# EAGLE board 2_auto (EAGLE 5.10)
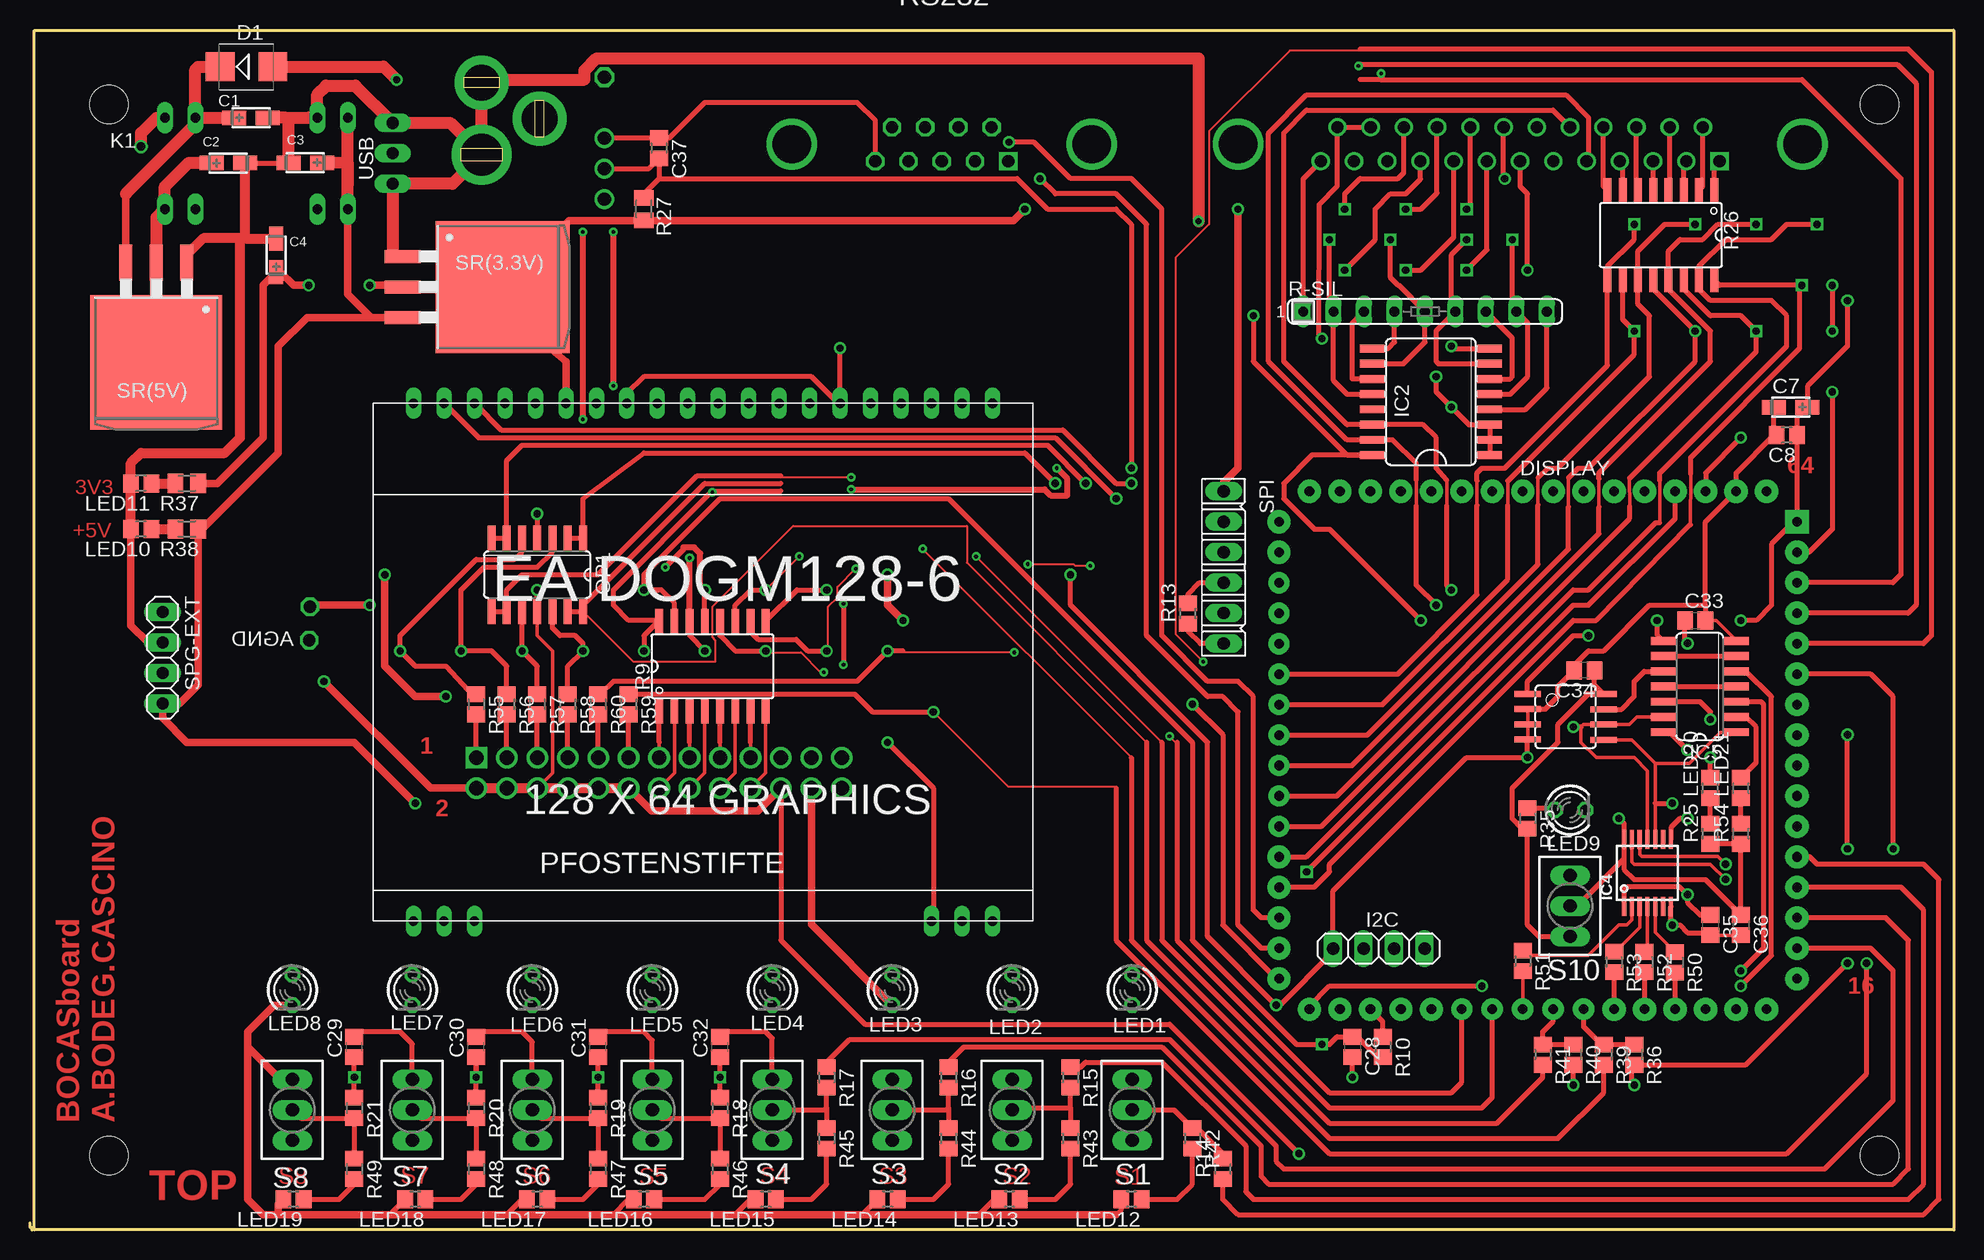
[diagram p2: board, top side]
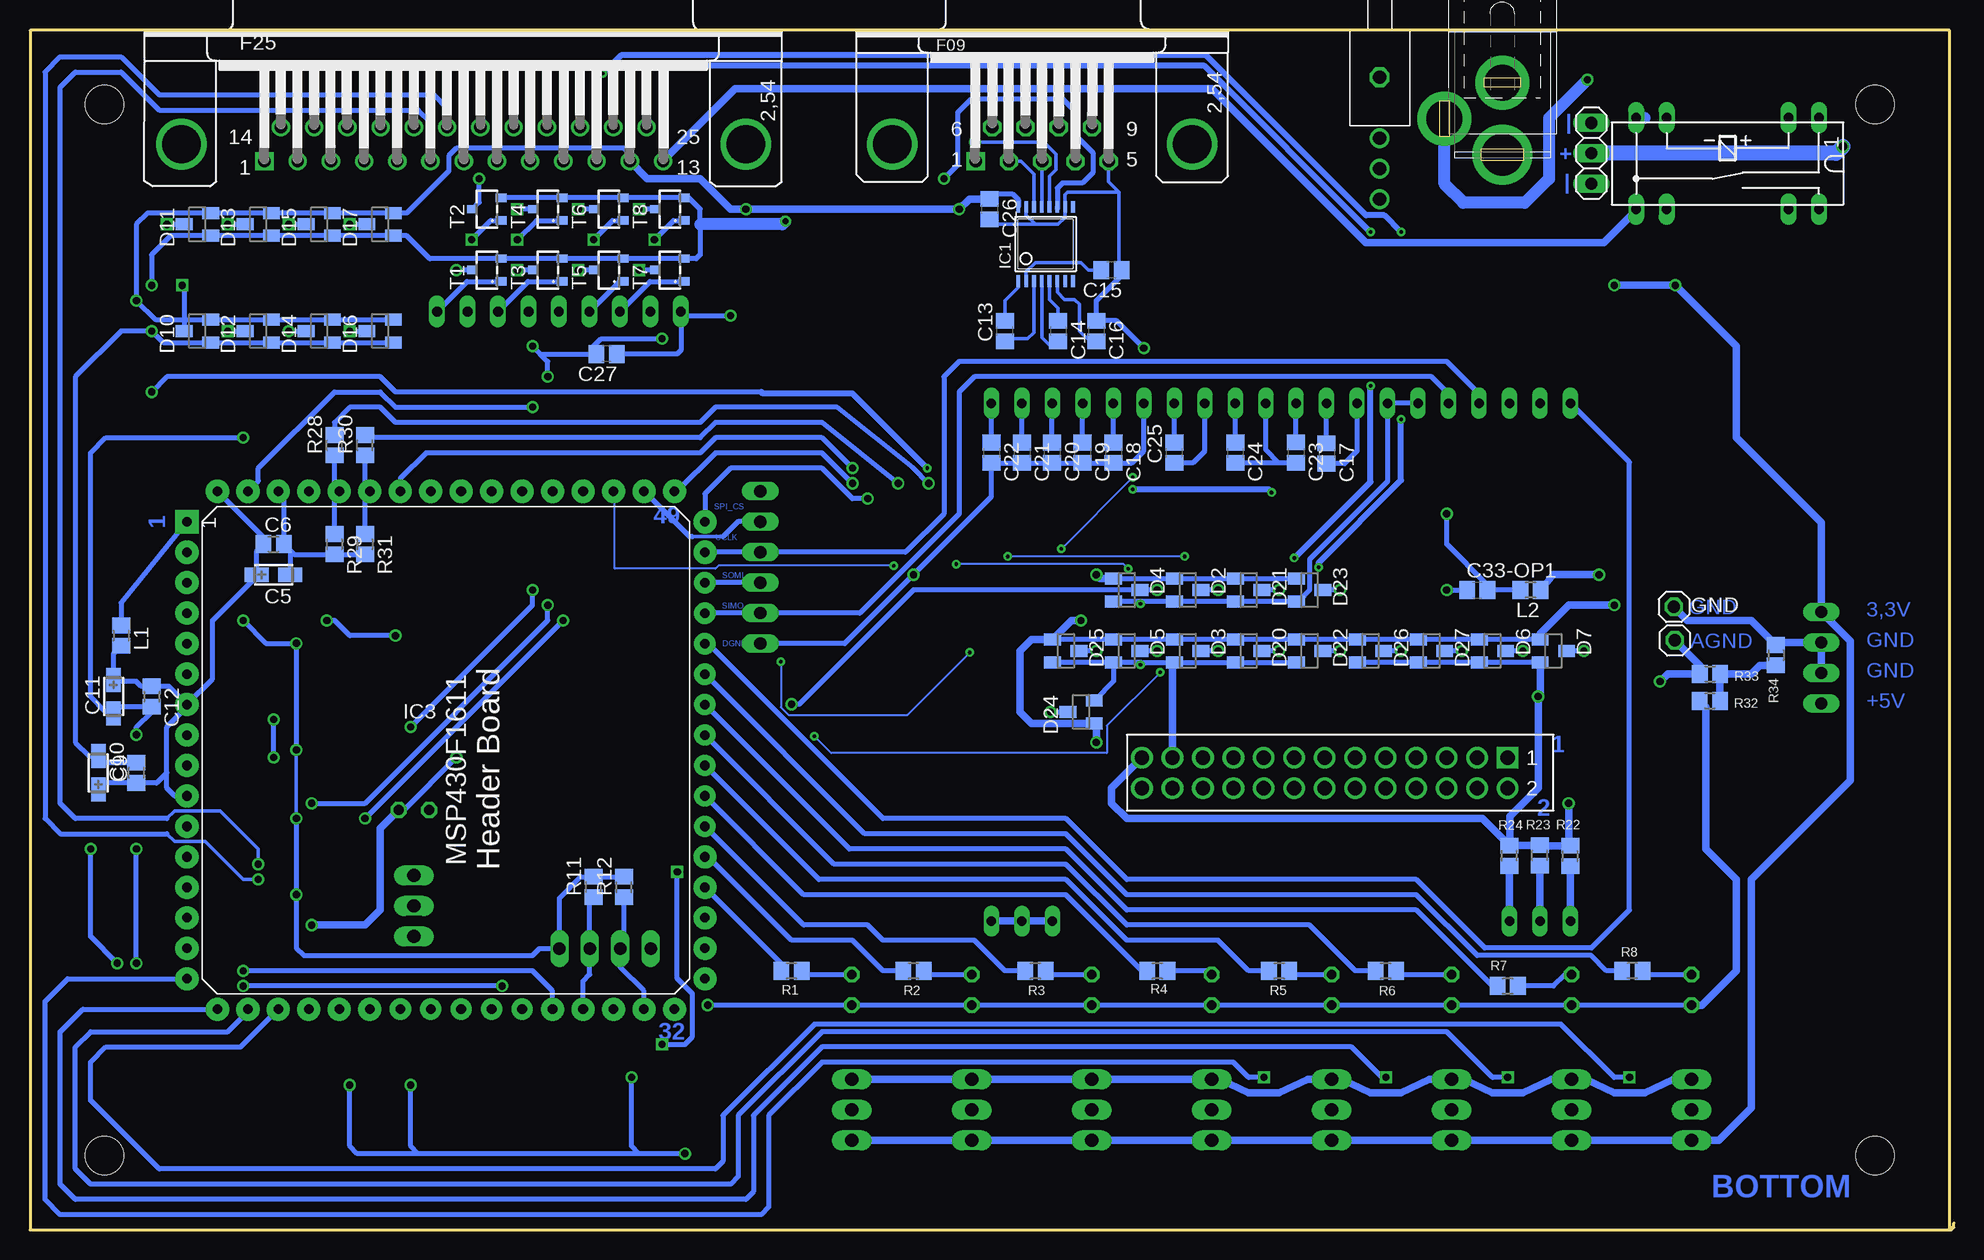
[diagram p3: board, bottom side, seen from below]

Size 160.37 x 100.02 mm. Coordinates in mm from the lower left corner, seen from the top.
Outline: 160.37,100 0.37,100
Outline: 0.37,0 0.37,100
Outline: 0.37,100 160.34,100.02 160.37,100
Outline: 160.37,100 160.37,0 0.37,0
Outline: 0.37,0 0.18,0 0.18,0.18 0,0.18 0,0.56
Copper layers (1*16): Top 0.035mm / dielectric 1.5mm / Bottom 0.035mm
Design rules "default *": minimum track width 6mil, minimum drill 12mil, track to track 8mil, track to pad 8mil, pad to pad 8mil, via to via 8mil, smd to smd 8mil, copper to edge 40mil, drill to drill 8mil, minimum pad ring 10mil, minimum via ring 8mil, stop-mask expansion 4mil, vias tented up to drill 0mil, thermal gap 10mil
Net classes: 1 Power: width 0.61 mm, drill 0.406 mm, clearance 0.203 mm; 2 High Strom: width 1.016 mm, drill 0.508 mm, clearance 0.203 mm; 3 Digital: width 0.152 mm, drill 0.305 mm, clearance 0.152 mm; 4 Analog: width 0.508 mm, drill 0.305 mm, clearance 0.203 mm; 5 VCC +3.3V: width 0.406 mm, drill 0.305 mm, clearance 0.203 mm
Holes 3.2 mm at 6.57,93.8 6.57,6.2 154.17,6.2 154.17,93.8

## Footprints (pad centres in the part's own frame; a part is rotated, then mirrored left to right if it is on the bottom)
1X01 = drill 1.016 octagon: 1 0,0
CT3216 = smd 2 x 1.2: + 1.4,0; - -1.4,0
R0805 = smd 1.3 x 1.5: 1 -0.85,0; 2 0.85,0
C0805 = smd 1.3 x 1.5: 1 -0.85,0; 2 0.85,0
SMB = smd 2.4 x 2.4: A 2.2,0; C -2.2,0
SOT23 = smd 1 x 1.4: 1 -0.95,-1.1; 2 0.95,-1.1; 3 0,1.1
F25-HORIZONTAL_2 = drill 1.016 square: 1 16.62,10.92 | drill 1.016 round: 2 13.85,10.92; 3 11.08,10.92; 4 8.31,10.92; 5 5.54,10.92; 6 2.77,10.92; 7 0,10.92; 8 -2.77,10.92; 9 -5.54,10.92; 10 -8.31,10.92; 11 -11.08,10.92; 12 -13.85,10.92; 13 -16.62,10.92; 14 15.235,8.08; 15 12.465,8.08; 16 9.695,8.08; 17 6.925,8.08; 18 4.155,8.08; 19 1.385,8.08; 20 -1.385,8.08; 21 -4.155,8.08; 22 -6.925,8.08; 23 -9.695,8.08; 24 -12.465,8.08; 25 -15.235,8.08 | drill 3.2 round: P$1 -23.52,9.5; P$2 23.52,9.5
EADOGM128 = drill 0.8 long: 1 -24.13,-21.59; 2 -21.59,-21.59; 3 -19.05,-21.59; 18 19.05,-21.59; 19 21.59,-21.59; 20 24.13,-21.59; 21 24.13,21.59; 22 21.59,21.59; 23 19.05,21.59; 24 16.51,21.59; 25 13.97,21.59; 26 11.43,21.59; 27 8.89,21.59; 28 6.35,21.59; 29 3.81,21.59; 30 1.27,21.59; 31 -1.27,21.59; 32 -3.81,21.59; 33 -6.35,21.59; 34 -8.89,21.59; 35 -11.43,21.59; 36 -13.97,21.59; 37 -16.51,21.59; 38 -19.05,21.59; 39 -21.59,21.59; 40 -24.13,21.59
1X04 = drill 1.016 long: 1 -3.81,0; 2 -1.27,0; 3 1.27,0; 4 3.81,0
TSSOP16 = smd 0.305 x 0.991: 1 -2.275,-3.1; 2 -1.625,-3.1; 3 -0.975,-3.1; 4 -0.325,-3.1; 5 0.325,-3.1; 6 0.975,-3.1; 7 1.625,-3.1; 8 2.275,-3.1; 9 2.275,3.1; 10 1.625,3.1; 11 0.975,3.1; 12 0.325,3.1; 13 -0.325,3.1; 14 -0.975,3.1; 15 -1.625,3.1; 16 -2.275,3.1
SO16L = smd 0.66 x 2.032: 1 -4.445,-4.902; 2 -3.175,-4.902; 3 -1.905,-4.902; 4 -0.635,-4.902; 5 0.635,-4.902; 6 1.905,-4.902; 7 3.175,-4.902; 8 4.445,-4.902; 9 4.445,4.902; 10 3.175,4.902; 11 1.905,4.902; 12 0.635,4.902; 13 -0.635,4.902; 14 -1.905,4.902; 15 -3.175,4.902; 16 -4.445,4.902
SOIC8 = smd 0.5 x 2.2: 1 -1.905,-3.154; 2 -0.645,-3.154; 3 0.625,-3.154; 4 1.895,-3.154; 5 1.905,3.154; 6 0.635,3.154; 7 -0.635,3.154; 8 -1.905,3.154
TSSOP14 = smd 0.35 x 1.6: 1 -1.95,-2.8; 2 -1.3,-2.8; 3 -0.65,-2.8; 4 0,-2.8; 5 0.65,-2.8; 6 1.3,-2.8; 7 1.95,-2.8; 8 1.95,2.8; 9 1.3,2.8; 10 0.65,2.8; 11 0,2.8; 12 -0.65,2.8; 13 -1.3,2.8; 14 -1.95,2.8
SO14 = smd 0.66 x 2.032: 1 -3.81,-3.073; 2 -2.54,-3.073; 3 -1.27,-3.073; 4 0,-3.073; 5 1.27,-3.073; 6 2.54,-3.073; 7 3.81,-3.073; 8 3.81,3.073; 9 2.54,3.073; 10 1.27,3.073; 11 0,3.073; 12 -1.27,3.073; 13 -2.54,3.073; 14 -3.81,3.073
RR1U = drill 0.813 long: 1 -7.62,-3.81; 2 -5.08,-3.81; 6 5.08,-3.81; 7 7.62,-3.81; 8 7.62,3.81; 9 5.08,3.81; 13 -5.08,3.81; 14 -7.62,3.81
LED3MM = drill 0.813 octagon: A -1.27,0; K 1.27,0
ML26 = drill 1.2 square: 1 -15.24,-1.27 | drill 1.2 round: 2 -15.24,1.27; 3 -12.7,-1.27; 4 -12.7,1.27; 5 -10.16,-1.27; 6 -10.16,1.27; 7 -7.62,-1.27; 8 -7.62,1.27; 9 -5.08,-1.27; 10 -5.08,1.27; 11 -2.54,-1.27; 12 -2.54,1.27; 13 0,-1.27; 14 0,1.27; 15 2.54,-1.27; 16 2.54,1.27; 17 5.08,-1.27; 18 5.08,1.27; 19 7.62,-1.27; 20 7.62,1.27; 21 10.16,-1.27; 22 10.16,1.27; 23 12.7,-1.27; 24 12.7,1.27; 25 15.24,-1.27; 26 15.24,1.27
SO16-F = smd 0.66 x 2.032: 1 -4.445,-3.748; 2 -3.175,-3.748; 3 -1.905,-3.748; 4 -0.635,-3.748; 5 0.635,-3.748; 6 1.905,-3.748; 7 3.175,-3.748; 8 4.445,-3.748; 9 4.445,3.748; 10 3.175,3.748; 11 1.905,3.748; 12 0.635,3.748; 13 -0.635,3.748; 14 -1.905,3.748; 15 -3.175,3.748; 16 -4.445,3.748
M0805 = smd 1.3 x 1.6: 1 -0.95,0; 2 0.95,0
SIL9 = drill 0.813 long: 1 -10.16,0; 2 -7.62,0; 3 -5.08,0; 4 -2.54,0; 5 0,0; 6 2.54,0; 7 5.08,0; 8 7.62,0; 9 10.16,0
F09-H1 = drill 1.016 square: 1 5.54,10.92 | drill 1.016 octagon: 2 2.77,10.92; 3 0,10.92; 4 -2.77,10.92; 5 -5.54,10.92; 6 4.155,8.08; 7 1.385,8.08; 8 -1.385,8.08; 9 -4.155,8.08 | drill 3.2 round: P$1 -12.495,9.5; P$2 12.495,9.5
2MS = drill 1.1 pad 1.422 long: 1 -2.54,0; 2 0,0; 3 2.54,0
KIPPTASTER-90 = drill 1.1 round: P1 0,2.54; P2 0,5.08; P3 0,7.62 | drill 1.1 octagon: P$4 0,-2.54
PFOSTENSTECKER-P06 = drill 1.016 long: 1 -6.35,0; 2 -3.81,0; 3 -1.27,0; 4 1.27,0; 5 3.81,0; 6 6.35,0
TO263-3 = smd 1.067 x 3: 1 -2.54,-5.791; 2 0,-5.791; 3 2.54,-5.791 | smd 11 x 11.2: TAB 0,2.54
SOT346 = smd 0.7 x 0.9: 1 -0.95,-1.2; 2 0.95,-1.2; 3 0,1.2
MCKU = drill 0.8 pad 1.93 square: 1 -22.86,-20.32 | drill 0.8 pad 1.93 round: 2 -20.32,-20.32; 3 -17.78,-20.32; 4 -15.24,-20.32; 5 -12.7,-20.32; 6 -10.16,-20.32; 7 -7.62,-20.32; 8 -5.08,-20.32; 9 -2.54,-20.32; 10 0,-20.32; 11 2.54,-20.32; 12 5.08,-20.32; 13 7.62,-20.32; 14 10.16,-20.32; 15 12.7,-20.32; 16 15.24,-20.32; 17 17.78,-17.78; 18 17.78,-15.24; 19 17.78,-12.7; 20 17.78,-10.16; 21 17.78,-7.62; 22 17.78,-5.08; 28 17.78,10.16; 29 17.78,12.7; 30 17.78,15.24; 31 17.78,17.78; 32 17.78,20.32; 33 15.24,22.86; 34 12.7,22.86; 35 10.16,22.86; 36 7.62,22.86; 37 5.08,22.86; 47 -20.32,22.86; 48 -22.86,22.86; 49 -25.4,20.32; 50 -25.4,17.78; 51 -25.4,15.24; 52 -25.4,12.7; 53 -25.4,10.16; 54 -25.4,7.62; 55 -25.4,5.08; 56 -25.4,2.54; 57 -25.4,0; 58 -25.4,-2.54; 59 -25.4,-5.08; 60 -25.4,-7.62; 61 -25.4,-10.16; 62 -25.4,-12.7; 63 -25.4,-15.24; 64 -25.4,-17.78 | drill 0.8 pad 1.778 round: 23 17.78,-2.54; 24 17.78,0; 25 17.78,2.54; 26 17.78,5.08; 27 17.78,7.62; 38 2.54,22.86; 39 0,22.86; 40 -2.54,22.86; 41 -5.08,22.86; 42 -7.62,22.86; 43 -10.16,22.86; 44 -12.7,22.86; 45 -15.24,22.86; 46 -17.78,22.86
1X03 = drill 1.016 long: 1 -2.54,0; 2 0,0; 3 2.54,0
VCC-BUCHSE-MULTIOCOMP = drill 3 pad 4.5 round: 1 0,-4.8; 2 -3,0 | drill 3.5 pad 5 round: 3 3,0

## Placement (x,y rotation side)
AGND  [1X01]  23.27,49.15 0 bottom
C1  10uF  [CT3216]  18.43,92.7 180 top
C2  10uF  [CT3216]  16.53,88.93 180 top
C3  10uF  [CT3216]  22.95,88.95 0 top
C4  10uF  [CT3216]  20.52,81.25 270 top
C5  10uF  [CT3216]  140.07,54.61 180 bottom
C6  100nF  [R0805]  140.07,57.15 0 bottom
C7  10uF  [CT3216]  146.76,68.58 0 top
C8  100nF  [R0805]  146.43,66.26 180 top
C9  10uF  [CT3216]  154.67,38.1 270 bottom
C10  100nF  [R0805]  151.5,38.1 90 bottom
C11  10uF  [CT3216]  153.4,44.45 90 bottom
C12  100nF  [R0805]  150.23,44.45 270 bottom
C13  100nF  [C0805]  79.11,74.93 90 bottom
C14  100nF  [C0805]  74.66,74.93 270 bottom
C15  100nF  [C0805]  70.22,80.01 180 bottom
C16  100nF  [C0805]  71.49,74.93 270 bottom
C17  1uF  [C0805]  52.29,64.73 270 bottom
C18  1uF  [C0805]  70.06,64.78 270 bottom
C19  1uF  [C0805]  72.65,64.78 270 bottom
C20  1uF  [C0805]  75.17,64.78 270 bottom
C21  1uF  [C0805]  77.69,64.78 270 bottom
C22  1uF  [C0805]  80.23,64.78 270 bottom
C23  1uF  [C0805]  54.86,64.78 270 bottom
C24  1uF  [C0805]  59.91,64.78 270 bottom
C25  1uF  [C0805]  64.98,64.78 90 bottom
C26  100nF  [C0805]  80.38,85.09 270 bottom
C27  100nF  [C0805]  112.3,73.02 180 bottom
C28  100nF  [C0805]  110.22,15.24 270 top
C29  1uF  [C0805]  27.04,15.24 90 top
C30  1uF  [C0805]  37.2,15.24 90 top
C31  1uF  [C0805]  47.36,15.24 90 top
C32  1uF  [C0805]  57.52,15.24 90 top
C33  100nF  [C0805]  138.8,50.8 0 top
C33-OP1  100nF  [C0805]  39.74,53.34 0 bottom
C34  100nF  [C0805]  129.55,46.64 180 top
C35  100nF  [C0805]  140.07,25.4 270 top
C36  100nF  [C0805]  142.61,25.4 270 top
C37  100nF  [R0805]  52.44,90.17 270 top
D1  [SMB]  18.05,96.97 0 top
D2  BAS40-04  [SOT23]  63.87,53.34 270 bottom
D3  BAS40-04  [SOT23]  63.87,48.26 270 bottom
D4  BAS40-04  [SOT23]  68.95,53.34 270 bottom
D5  BAS40-04  [SOT23]  68.95,48.26 270 bottom
D6  BAS40-04  [SOT23]  38.47,48.26 270 bottom
D7  BAS40-04  [SOT23]  33.39,48.26 270 bottom
D10  [SOT23]  146.42,74.93 90 bottom
D11  [SOT23]  146.42,83.82 90 bottom
D12  [SOT23]  141.34,74.93 90 bottom
D13  [SOT23]  141.34,83.82 90 bottom
D14  [SOT23]  136.26,74.93 90 bottom
D15  [SOT23]  136.26,83.82 90 bottom
D16  [SOT23]  131.18,74.93 90 bottom
D17  [SOT23]  131.18,83.82 90 bottom
D20  [SOT23]  58.79,48.26 270 bottom
D21  BAS40-04  [SOT23]  58.79,53.34 270 bottom
D22  [SOT23]  53.71,48.26 270 bottom
D23  [SOT23]  53.71,53.34 270 bottom
D24  BAS40-04  [SOT23]  72.76,43.18 90 bottom
D25  BAS40-04  [SOT23]  74.03,48.26 270 bottom
D26  BAS40-04  [SOT23]  48.63,48.26 270 bottom
D27  BAS40-04  [SOT23]  43.55,48.26 270 bottom
D-SUB-25  [F25-HORIZONTAL_2]  124.21,100 180 bottom
DISPLAY  EADOGM128  [EADOGM128]  56.1,47.32 0 top
GND  [1X01]  23.34,51.94 0 bottom
I2C  [1X04]  112.43,23.45 180 top
IC1  MAX3232IPW  [TSSOP16]  75.71,82.18 0 bottom
IC2  PCF8574AT  [SO16L]  116.77,69.03 90 top
IC3  AT24C02BN-SHB  [SOIC8]  128,42.76 270 top
IC4  TX0104E  [TSSOP14]  134.82,29.75 0 top
IC5  74HC04D  [SO14]  139.19,45.29 90 top
K1  DIP05-1C90-51D  [RR1U]  18.87,88.9 180 bottom
L1  10µ?  [R0805]  152.77,49.53 270 bottom
L2  10µ?  [R0805]  35.29,53.34 180 bottom
LED1  1.7V  [LED3MM]  91.87,20 270 top
LED2  1.7V  [LED3MM]  81.87,20 270 top
LED3  1.7V  [LED3MM]  71.87,20 270 top
LED4  1.7V  [LED3MM]  61.87,20 270 top
LED5  1.7V  [LED3MM]  51.87,20 270 top
LED6  1.7V  [LED3MM]  41.87,20 270 top
LED7  1.7V  [LED3MM]  31.87,20 270 top
LED8  1.7V  [LED3MM]  21.87,20 270 top
LED9  1.7V  [LED3MM]  128.37,35 0 top
LED10  [R0805]  9.26,58.42 180 top
LED11  [R0805]  9.26,62.23 180 top
LED12  [R0805]  91.81,2.54 180 top
LED13  [R0805]  81.65,2.54 180 top
LED14  [R0805]  71.49,2.54 180 top
LED15  [R0805]  61.33,2.54 180 top
LED16  [R0805]  51.17,2.54 180 top
LED17  [R0805]  42.28,2.54 180 top
LED18  [R0805]  32.12,2.54 180 top
LED19  [R0805]  21.96,2.54 180 top
LED20  [R0805]  140.07,36.83 90 top
LED21  [R0805]  142.61,36.83 90 top
OP1  MCP6054SOIC14  [SO14]  42.28,54.61 180 top
PFOSTENSTIFTE  D-Sub-25pol-2  [ML26]  52.44,38.1 180 bottom
R1  750R  [R0805]  96.89,21.59 180 bottom
R2  750R  [R0805]  86.73,21.59 180 bottom
R3  750R  [R0805]  76.57,21.59 180 bottom
R4  750R  [R0805]  66.41,21.59 180 bottom
R5  750R  [R0805]  56.25,21.59 180 bottom
R6  750R  [R0805]  47.36,21.59 180 bottom
R7  750R  [R0805]  37.2,20.32 180 bottom
R8  750R  [R0805]  26.81,21.6 180 bottom
R9  1k  [SO16-F]  56.88,46.99 0 top
R10  1k6  [R0805]  112.76,15.24 270 top
R11  2k2  [R0805]  113.4,28.57 90 bottom
R12  2k2  [R0805]  110.86,28.57 90 bottom
R13  100k  [R0805]  96.53,51.38 90 top
R14  1K  [R0805]  99.43,5.08 90 top
R15  1K  [R0805]  86.73,12.7 270 top
R16  1K  [R0805]  76.57,12.7 270 top
R17  1K  [R0805]  66.41,12.7 270 top
R18  1K  [R0805]  57.52,10.16 270 top
R19  1K  [R0805]  47.36,10.16 270 top
R20  1K  [R0805]  37.2,10.16 270 top
R21  1K  [R0805]  27.04,10.16 270 top
R22  0.1k  [R0805]  31.98,31.16 90 bottom
R23  0.1k  [R0805]  34.53,31.21 90 bottom
R24  0.1k  [R0805]  37.06,31.19 90 bottom
R25  1K5  [R0805]  140.07,33.02 90 top
R26  1k  [SO16-F]  135.94,82.92 180 top
R27  68K  [M0805]  51.17,85.09 270 top
R28  10K 1%  [R0805]  134.99,65.41 90 bottom
R29  10K 1%  [R0805]  134.99,57.15 270 bottom
R30  10K 1%  [R0805]  132.45,65.41 90 bottom
R31  10K 1%  [R0805]  132.45,57.15 270 bottom
R32  0k  [R0805]  20.35,44.1 0 bottom
R33  0k  [R0805]  20.33,46.33 0 bottom
R34  0k  [R0805]  14.83,47.9 270 bottom
R35  1K5  [R0805]  124.83,34.29 270 top
R36  10K 1%  [R0805]  133.72,14.61 270 top
R37  750R  [M0805]  13.07,62.23 180 top
R38  1K5  [M0805]  13.07,58.42 180 top
R39  10K 1%  [R0805]  131.18,14.61 270 top
R40  10K 1%  [R0805]  128.64,14.61 270 top
R41  10K 1%  [R0805]  126.1,14.61 270 top
R42  750R  [R0805]  96.89,7.62 270 top
R43  750R  [R0805]  86.73,7.62 270 top
R44  750R  [R0805]  76.57,7.62 270 top
R45  750R  [R0805]  66.41,7.62 270 top
R46  750R  [R0805]  57.52,5.08 270 top
R47  750R  [R0805]  47.36,5.08 270 top
R48  750R  [R0805]  37.2,5.08 270 top
R49  750R  [R0805]  27.04,5.08 270 top
R50  470R  [R0805]  137.12,22.3 270 top
R51  470R  [R0805]  124.43,22.41 270 top
R52  470R  [R0805]  134.58,22.32 270 top
R53  470R  [R0805]  132.04,22.33 270 top
R54  1K5  [R0805]  142.61,33.02 90 top
R55  1K  [R0805]  37.2,43.81 270 top
R56  1K  [R0805]  39.74,43.81 270 top
R57  1K  [R0805]  42.28,43.81 270 top
R58  1K  [R0805]  44.82,43.81 270 top
R59  100R  [R0805]  49.9,43.81 270 top
R60  100R  [R0805]  47.36,43.81 270 top
R-SIL  3k3  [SIL9]  116.28,76.56 0 top
RS232  [F09-H1]  76,100 180 bottom
S1  [2MS]  91.87,10 270 top
S2  [2MS]  81.87,10 270 top
S3  [2MS]  71.87,10 270 top
S4  [2MS]  61.87,10 270 top
S5  [2MS]  51.87,10 270 top
S6  [2MS]  41.87,10 270 top
S7  [2MS]  31.87,10 270 top
S8  [2MS]  21.87,10 270 top
S10  [2MS]  128.37,27 270 top
S11  RESET-KIPPTASTER  [KIPPTASTER-90]  47.87,93.55 180 bottom
SPG-EXT  [1X04]  11.05,47.69 270 top
SPI  [PFOSTENSTECKER-P06]  99.49,55.22 270 top
SR(3.3V)  LM1086-3.3V  [TO263-3]  36.86,78.59 270 top
SR(5V)  LM1086-5V  [TO263-3]  10.53,74.84 180 top
T1  [SOT346]  122.29,80.01 90 bottom
T2  [SOT346]  122.29,85.09 90 bottom
T3  [SOT346]  117.21,80.01 90 bottom
T4  [SOT346]  117.21,85.09 90 bottom
T5  [SOT346]  112.13,80.01 90 bottom
T6  [SOT346]  112.13,85.09 90 bottom
T7  [SOT346]  107.05,80.01 90 bottom
T8  [SOT346]  107.05,85.09 90 bottom
U$1  HEADER_BOARD_2  [MCKU]  126.97,36.17 270 bottom
USB  [1X03]  30.22,89.74 270 bottom
VCC-BUCHSE  [VCC-BUCHSE-MULTIOCOMP]  37.66,92.64 270 bottom

## Tracks (layer width: path | path; a pad name or v marks a point on that pad's centre or on a via)
+3V3  (via drill 0.3, 0.6)
  Top 0.406: IC4.1 132.87,28.36 133.08,28.57 137.53,28.57 v138.16,27.94 138.16,27.3 139.22,26.25 C35.1 | IC4.8 136.77,33.53 137.53,34.29 v138.16,34.29 | IC5.14 136.69,41.48 v138.16,40.01 | v151.5,77.47 151.5,73.66 148.16,70.32 C7.+ 147.28,67.7 C8.1 147.29,66.24 U$1.1 147.03,59.03 145.15,57.15 145.15,52.07 143.88,50.8 v142.61,50.8 | C33.1 137.95,49.11 v138.16,48.9 | v67.81,52.2 v67.81,47.12
  Top 0.61: SR(3.3V).TAB 44.94,84.14 R27.2 81.97,84.14 v82.92,85.09 | DISPLAY.35 44.67,72.39 37.2,78.59 | v23.23,78.74 21.96,78.74 20.85,79.84 C4.+ 19.42,78.75 19.42,66.04 15.61,62.23 R37.1 | v28.31,78.74 30.92,78.74 SR(3.3V).2 | SPI.1 99.49,62.29 100.7,63.5 v100.7,85.09
  Top 1.016: SR(3.3V).TAB 37.2,78.59 SR(3.3V).2
  Bottom 0.305: v138.16,40.01 v138.16,34.29
  Bottom 0.406: D16.2 D14.2 D12.2 D10.2 149.91,75.88 v151.5,77.47 151.5,83.82 150.55,84.77 D11.2 D13.2 D15.2 D17.2 128.96,84.77 125.46,88.27 125.46,89.53 124.83,90.17 110.86,90.17 110.36,89.67 D-SUB-25.12 | R12.2 R11.2 114.45,29.43 116.24,27.64 I2C.1 117.89,23.45 118.48,22.86 137.53,22.86 138.16,23.5 v138.16,27.94 v138.16,34.29 | D22.2 D20.2 D3.2 | 67.81,47.31 D3.2 | 67.81,47.31 D5.2 | 67.81,52.39 D2.2 D21.2 D23.2 54.66,52.39 53.71,53.34 53.71,55.88 47.21,62.38 DISPLAY.34 DISPLAY.35 | 67.81,52.39 D4.2 | D5.2 D25.2 | v138.16,40.01 v138.16,48.9 140.7,48.9 v142.61,50.8 | L1.1 152.77,52.28 U$1.1 | IC1.16 77.99,85.87 78.47,86.36 79.96,86.36 C26.1 | D5.2 70.05,45.74 D24.2 | D3.2 65.14,47.14 | v67.81,47.12 67.81,47.31 | 67.81,52.39 v67.81,52.2
  Bottom 0.61: S1.3 S2.3 S3.3 S4.3 S5.3 S6.3 S7.3 S8.3 19.58,7.46 16.88,10.16 16.88,29.21 8.62,37.47 8.62,49.07 SPG-EXT.1 11.05,58.94 18.15,66.04 18.15,73.66 v23.23,78.74 v28.31,78.74 | C26.1 82.07,85.94 v82.92,85.09 v100.7,85.09 101.97,85.09 104.51,87.63 108.91,87.63 D-SUB-25.12 | 65.14,47.14 PFOSTENSTIFTE.23
+5V  (via drill 0.6)
  Top 0.406: R25.1 R54.1 C36.1 139.65,29.21 133.72,29.21 132.87,30.06 132.87,30.9 | R-SIL.1 106.12,87.6 D-SUB-25.13 | 132.87,30.9 IC4.14 132.87,33.87 v132.45,34.29 | S10.2 128.97,27 132.87,30.9 | v101.97,76.2 101.97,72.39 109.77,64.59 IC2.16 106.87,64.59 104.51,62.23 104.51,60.96 107.05,58.42 108.32,58.42 v115.94,50.8
  Top 0.61: K1.8 26.49,78.02 28.46,76.05 | 28.46,76.05 SR(3.3V).3 | 28.46,76.05 23.08,76.05 20.69,73.66 20.69,64.77 14.34,58.42 R38.1 14.02,45.4 12.5,43.88 SPG-EXT.4 11.05,42.66 13.07,40.64 27.04,40.64 v32.12,35.56 | v29.58,54.61 29.58,46.99 32.12,44.45 v34.66,44.45
  Top 1.016: K1.7 K1.8 26.5,88.9 C3.+
  Bottom 0.305: R-SIL.1 105.76,76.2
  Bottom 0.406: 37.03,32.06 R24.2 | D7.2 D6.2 D27.2 D26.2 | C27.1 106.42,73.02 106.12,73.32 R-SIL.1 | 34.48,32.01 R23.2 | 105.76,76.2 v101.97,76.2 | v115.94,50.8 v132.45,34.29
  Bottom 0.61: R23.2 37.03,32.06 37.03,34.46 34.66,36.83 v34.66,44.45 34.49,44.62 D7.2 | 34.48,32.01 R22.2 32.12,32.15 v32.12,35.56 | v29.58,54.61 33.39,54.61 L2.1 | PFOSTENSTIFTE.25 70.22,36.83 70.22,35.56 68.95,34.29 39.31,34.29 R24.2 | D-SUB-25.13 107.56,89.15 101.59,95.12 61.84,95.12 49.01,82.3 29.2,82.3 26.53,84.96 K1.8
  Bottom 1.016: K1.7 25.77,92.71
A0  (via drill 0.6)
  Top 0.406: OP1.5 41.01,56.52 40.37,55.88 37.2,55.88 30.85,49.53 v30.85,48.26 32.12,46.99 34.66,46.99 36.98,44.45 R55.1
  Bottom 0.406: v30.85,48.26 D7.3
A0#
  Top 0.406: PFOSTENSTIFTE.1 R55.2
A1  (via drill 0.6)
  Top 0.406: R56.1 39.74,46.99 38.47,48.26 v35.93,48.26 35.93,53.34 37.83,55.24 42.28,55.24 43.55,56.52 OP1.3
  Bottom 0.406: v35.93,48.26 D6.3
A1#
  Top 0.406: PFOSTENSTIFTE.3 R56.2
A2_TX
  Top 0.305: 134.17,23.58 R52.1 134.82,23.42 IC4.4
A3_TX
  Top 0.305: IC4.3 134.17,25.22 132.13,23.18 R53.1
A4_TX
  Top 0.305: R51.1 124.83,22.86 129.91,22.86 132.45,25.4 133.08,25.4 133.52,25.84 IC4.2
ADC0
  Bottom 0.406: R30.1 132.45,61.97 U$1.59 132.45,61.17 R31.1
ADC1
  Bottom 0.406: R28.1 134.99,61.97 U$1.60 134.99,61.17 R29.1
ADC2  (via drill 0.6)
  Top 0.406: v51.17,53.34 52.44,53.34 | U$1.61 137.13,59.29 129.91,52.07 128.64,52.07 v106.41,29.84 | R10.2 112.55,14.61 112.13,14.61 110.64,16.09 C28.1 108.95,16.09 108.32,15.46 v107.68,15.46 105.56,15.46 96.89,24.13 96.89,40.64 76.57,60.96 57.52,60.96 51.17,54.61 v51.17,53.34 | R9.15 53.71,52.24 D23.3 v51.17,53.34
  Bottom 0.406: v51.17,53.34 D23.3 | v106.41,29.84 106.41,20.95 105.14,19.68 105.14,16.09 105.78,15.46 v107.68,15.46
ADC3  (via drill 0.3, 0.6)
  Top 0.406: 52.44,50.8 51.17,49.53 v51.17,48.26 | 62.6,61.59 56.88,61.59 56.82,61.53 48.63,53.34 48.63,52.07 49.9,50.8 52.37,50.8 R9.16 | U$1.2 148.3,56.49 150.23,58.42 v150.23,69.85
  Top 0.508: v68.44,61.72 84.57,61.72 85.08,61.21 86.48,61.21 86.48,62.61 v85.59,63.5 | 56.82,61.53 v56.88,61.47
  Top 0.61: R9.16 52.44,50.8
  Bottom 0.406: v51.17,48.26 D22.3 | v150.23,69.85 148.96,71.12 131.18,71.12 129.91,69.85 99.43,69.85
  Bottom 0.508: v56.88,61.47 57.14,61.72 v68.44,61.72 | v85.59,63.5 91.81,69.72 99.3,69.72 99.43,69.85
ADC4  (via drill 0.3, 0.6)
  Top 0.406: v56.25,53.34 R9.13 | U$1.3 155.28,53.95 155.94,54.61 155.94,87.63 147.69,95.89 112.64,95.89 110.86,95.89
  Top 0.508: v52.95,55.24 54.47,56.77 54.47,56.9 55.36,56.9 55.87,56.39 55.87,53.72 v56.25,53.34 | v46.09,67.56 v46.09,83.19 | v112.64,96.39 112.64,95.89
  Bottom 0.406: v56.25,53.34 D21.3
  Bottom 0.508: v52.95,55.24 52.95,55.63 46.09,62.48 v46.09,67.56 | v46.09,83.19 47.49,84.58 49.01,84.58 62.35,97.92 111.11,97.92 v112.64,96.39
ADC5  (via drill 0.3, 0.6)
  Top 0.406: v56.25,48.26 54.98,49.53 R9.14 | U$1.4 156.55,51.41 157.21,52.07 157.21,95.57 155.63,97.16 110.86,97.16
  Top 0.508: v54.98,56.01 54.98,50.93 R9.14 | v48.63,70.36 v48.63,83.19 | v110.73,97.03 110.86,97.16
  Bottom 0.406: v56.25,48.26 D20.3
  Bottom 0.508: v54.98,56.01 48.63,62.36 v48.63,70.36 | v48.63,83.19 62.47,97.03 v110.73,97.03
AGND  (via drill 0.6)
  Top 0.305: PFOSTENSTIFTE.6 43.55,38.1 43.55,48.26 42.28,49.53 OP1.11
  Top 0.406: OP1.11 v42.28,53.34 | v151.5,22.23 143.03,13.76 R36.2 133.5,13.76 133.5,12.28 v133.72,12.06 | v151.5,31.75 v151.5,41.27 | U$1.62 139.67,63.1 v142.61,66.04 | v105.78,6.35 94.98,17.14 69.58,17.14 62.6,24.13 PFOSTENSTIFTE.22 | v110.22,12.7 C28.2 | v128.64,12.06 R40.2
  Top 0.61: PFOSTENSTIFTE.12 51.8,34.92 60.69,34.92 PFOSTENSTIFTE.22 | PFOSTENSTIFTE.2 33.39,36.83 v24.5,45.72
  Top 0.813: PFOSTENSTIFTE.2 PFOSTENSTIFTE.4 PFOSTENSTIFTE.6 PFOSTENSTIFTE.8 PFOSTENSTIFTE.10 PFOSTENSTIFTE.12
  Bottom 0.406: C6.2 139.22,61.12 U$1.62 | C5.- 138.67,56.6 C6.2 | R31.2 R29.2 138.37,56.3 C6.2 | 41.86,53.34 v42.28,53.34 C33-OP1.1 | v151.5,22.23 v151.5,31.75 | v142.61,66.04 154.04,66.04 155.31,64.77 155.31,44.45 154.04,43.18 153.53,43.18 C11.- 152.85,43.6 C12.2 150.23,43.18 151.5,41.91 v151.5,41.27 | v105.78,6.35 109.59,6.35 | 109.59,6.35 110.22,6.99 v110.22,12.7 | v128.64,12.06 128.64,6.99 128,6.35 | 109.59,6.35 128,6.35 | v133.72,12.06 133.72,6.99 133.08,6.35 128,6.35
  Bottom 0.61: v24.5,45.72 23.86,46.35 23.84,46.33 R33.1 21.18,47.06 AGND.1
AVCC_MSP
  Bottom 0.406: U$1.64 140.92,57.74 C6.1 141.47,56.6 C5.+ 141.47,54.48 145.15,50.8 145.15,45.93 U$1.7 | U$1.7 147.29,43.58 148.96,41.91 148.96,38.1 | U$1.10 148.3,36.17 148.96,36.83 148.96,38.1 | 148.96,38.1 149.81,37.25 C10.1 154.12,37.25 C9.+ | U$1.7 148.8,45.3 C12.1 151.08,45.3 151.5,45.72 153.27,45.72 C11.+ 153.4,48.05 L1.2
BUS_IO_EXP_P.0
  Top 0.406: IC2.4 124.65,68.4 126.44,70.19 R-SIL.9
  Bottom 0.406: T1.1 123.93,79.06 R-SIL.9
BUS_IO_EXP_P.2
  Top 0.406: IC2.6 123.38,70.94 123.56,71.12 123.56,74.35 R-SIL.7
  Bottom 0.406: T3.1 118.85,79.06 R-SIL.7
BUS_IO_EXP_P.3  (via drill 0.6)
  Top 0.406: v119.75,82.55 118.48,81.28 118.48,76.89 R-SIL.6 117.21,74.95 117.21,72.39 117.39,72.21 IC2.7
  Bottom 0.406: T4.1 118.16,84.14 v119.75,82.55
BUS_IO_EXP_P.4
  Top 0.406: R-SIL.4 113.74,74 113.22,73.48 IC2.9
  Bottom 0.406: T5.1 111.23,79.06 R-SIL.4
BUS_IO_EXP_P.5  (via drill 0.6)
  Top 0.406: v113.4,82.55 113.4,79.38 114.03,78.74 114.09,78.74 R-SIL.5 116.28,74 114.49,72.21 IC2.10
  Bottom 0.406: T6.1 111.81,84.14 v113.4,82.55
BUS_IO_EXP_P.6
  Top 0.406: IC2.11 110.22,70.94 110.22,75.58 R-SIL.3
  Bottom 0.406: T7.1 108.69,79.06 R-SIL.3
BUS_IO_EXP_P.7  (via drill 0.6)
  Top 0.406: v108.32,82.55 108.32,76.89 R-SIL.2 108.66,70.78 109.77,69.67 IC2.12
  Bottom 0.406: T8.1 106.73,84.14 v108.32,82.55
C0  (via drill 0.6)
  Top 0.406: R57.1 42.28,46.99 v41.01,48.26 OP1.10
  Bottom 0.406: v41.01,48.26 D27.3
C0#
  Top 0.406: PFOSTENSTIFTE.5 R57.2
C1  (via drill 0.6)
  Top 0.406: R58.1 44.82,46.99 v46.09,48.26 46.09,48.9 45.45,49.53 44.18,49.53 43.55,50.16 OP1.12
  Bottom 0.406: v46.09,48.26 D26.3
C1#
  Top 0.406: PFOSTENSTIFTE.7 R58.2
C1+
  Bottom 0.305: IC1.1 77.99,78.59 79.11,77.47 C13.2
C1-
  Bottom 0.305: IC1.3 76.69,74.81 77.2,74.3 78.89,74.3 C13.1
C2+
  Bottom 0.305: IC1.4 76.04,74.4 75.3,73.66 75.08,73.66 C14.2
CA0
  Top 0.406: R36.1 R39.1 130.96,15.46 129.51,16.91 U$1.23
CA1
  Top 0.406: U$1.24 126.97,17.38 126.1,16.51 R41.1 R40.1
DAC0  (via drill 0.3, 0.6)
  Top 0.152: v82.03,48.13 72.89,48.13 72.76,48.26 | v97.78,47.37 95.49,49.66 95.49,81.03 98.29,83.82 98.29,91.57 105.02,98.3 110.73,98.3 110.86,98.42
  Top 0.406: R60.1 47.57,44.66 48.63,45.72 68.95,45.72 v71.49,48.26 72.76,48.26 | U$1.5 157.82,48.87 158.48,49.53 158.48,96.52 156.58,98.42 110.86,98.42
  Bottom 0.152: v82.03,48.13 87.24,42.93 97.14,42.93 97.78,43.56 v97.78,47.37
  Bottom 0.406: v71.49,48.26 D25.3
DAC0#
  Top 0.406: PFOSTENSTIFTE.9 R60.2
DAC1  (via drill 0.6)
  Top 0.152: v75.3,43.18 81.52,36.96 90.41,36.96 90.54,36.83
  Top 0.406: R59.1 68.73,44.66 70.22,43.18 v75.3,43.18 | U$1.6 153.43,46.33 155.31,44.45 v155.31,31.75 | v153.09,22.23 153.09,13.02 146.42,6.35 108.32,6.35 90.54,24.13 90.54,36.83
  Bottom 0.406: v75.3,43.18 D24.3 | v155.31,31.75 155.31,24.45 v153.09,22.23
DAC1#
  Top 0.406: PFOSTENSTIFTE.11 R59.2
DGND  (via drill 0.6)
  Top 0.305: C35.2 C36.2 | IC3.4 IC3.3 IC3.2 | C33.2 140.56,50.8 IC5.7
  Top 0.406: LED12.2 90.96,1.69 90.54,1.27 | 69.37,1.27 LED14.2 | LED13.2 80.38,2.54 79.11,1.27 | 30,1.27 LED18.2 | LED17.2 41.01,2.54 39.74,1.27 | LED16.2 49.9,2.54 48.63,1.27 | LED15.2 60.06,2.54 58.79,1.27 | S4.1 61.87,15.97 61.33,16.51 57.94,16.51 C32.2 | S5.1 51.87,15.81 51.17,16.51 47.78,16.51 C31.2 | S6.1 41.87,15.65 41.01,16.51 37.62,16.51 C30.2 | C29.2 27.04,16.51 30.85,16.51 31.87,15.49 S7.1 | IC2.1 IC2.2 IC2.3 119.93,67.13 v118.48,68.58 117.21,69.85 v117.21,71.12 | S11.P1 47.88,91.02 C37.1 53.29,91.02 56.25,93.98 68.95,93.98 70.46,92.47 RS232.5 | IC2.8 118.66,73.48 v118.48,73.66 | IC3.4 124.83,40.85 v124.83,39.37 119.75,39.37 108.62,28.24 I2C.4 108.62,23.16 104.19,18.73 v103.87,18.73 98.16,24.45 98.16,40.64 86.73,52.07 v86.73,54.61 | R13.1 96.53,49.89 97.55,48.87 SPI.6 | IC4.7 136.77,25.52 v136.89,25.4 137.53,25.4 138.16,24.77 139.85,24.77 C35.2 | v107.68,74.3 107.45,74.59 107.46,85.48 108.98,87.02 D-SUB-25.25 D-SUB-25.24 | 139.65,52.07 139.65,59.01 U$1.63 142.21,63.1 145.37,66.26 | 139.65,52.07 C33.2 | v67.53,73.51 DISPLAY.26 67.34,68.92 65.14,71.12 51.17,71.12 49.75,69.7 DISPLAY.33 | 145.37,66.26 C8.2 | 145.37,66.26 C7.- | IC3.2 126.33,43.41 127.37,44.45 127.37,45.31 C34.2 128.7,47.05 129.91,48.26 131.18,48.26 134.99,52.07 139.65,52.07
  Top 0.61: 90.54,1.27 79.11,1.27 69.37,1.27 58.79,1.27 48.63,1.27 39.74,1.27 30,1.27 20.69,1.27 | 20.69,1.27 20.69,2.12 LED19.2 | LED8.K 20.37,18.73 18.15,16.51 18.15,15.24 | 18.15,15.24 18.15,2.54 19.42,1.27 20.69,1.27 | S8.1 20.85,12.54 18.15,15.24 | PFOSTENSTIFTE.24 65.14,25.46 LED3.K
  Bottom 0.305: 70.47,89.07 RS232.5 70.46,87.37 69.58,86.49 | IC1.15 77.33,85.1 77.33,84.58 76.57,83.82 | 73.43,86.49 73.89,86.49 74.09,86.29 74.09,85.1 IC1.10 74.09,84.4 74.66,83.82 76.57,83.82 | 73.43,86.49 73.44,86.49 | C16.1 71.27,76 | 69.58,86.49 73.43,86.49 | 69.58,86.49 69.58,80.22 C15.1 | 76.57,83.82 79.96,83.82 C26.2
  Bottom 0.406: LED8.K LED7.K LED6.K LED5.K LED4.K LED3.K LED2.K LED1.K v103.87,18.73 | LED9.K 129.2,35 v124.83,39.37 | DISPLAY.26 67.53,64.92 68.52,63.93 C18.2 C19.2 C20.2 C21.2 C22.2 80.23,61.11 v86.73,54.61 92.47,48.87 SPI.6 | C17.2 50.79,63.88 49.75,64.92 DISPLAY.33 | v117.21,71.12 117.21,72.39 v118.48,73.66 117.84,73.02 C27.2 113.4,73.27 113.4,73.66 112.76,74.3 v107.68,74.3 | C15.1 69.37,79.59 71.49,77.47 C16.1 69.8,75.78 v67.53,73.51 | U$1.63 141.34,62.44 141.34,63.5 134.99,69.85 131.18,69.85 129.91,68.58 v118.48,68.58
  Bottom 0.61: S1.1 S2.1 S3.1 S4.1 61.17,12.54 58.79,11.43 56.25,11.43 53.87,12.54 S5.1 51.01,12.54 48.63,11.43 46.09,11.43 43.71,12.54 S6.1 40.85,12.54 38.47,11.43 35.93,11.43 33.55,12.54 S7.1 30.69,12.54 28.31,11.43 25.77,11.43 23.39,12.54 S8.1 | LED8.K 21.01,18.73 18.15,21.59 18.15,29.21 20.69,31.75 20.69,43.59 R32.1 | v136.89,25.4 132.45,25.4 131.18,26.67 131.18,33.46 LED9.K
DISPL_A0  (via drill 0.6)
  Top 0.406: DISPLAY.38 39.29,66.67 86.09,66.67 90.54,62.23 v91.81,62.23
  Bottom 0.406: U$1.49 106.44,61.57 103.24,64.77 94.35,64.77 v91.81,62.23
DISPL_RST  (via drill 0.6)
  Top 0.406: DISPLAY.39 37.38,66.04 85.46,66.04 v90.54,60.96
  Bottom 0.406: U$1.48 104.11,61.36 101.97,63.5 94.35,63.5 91.81,60.96 v90.54,60.96
EEPROM_A0  (via drill 0.6)
  Top 0.406: IC5.5 143.04,46.56 145.15,44.45 145.15,22.86 v142.61,20.32 | v121.02,20.32 108.32,20.32 106.65,18.65 U$1.32
  Bottom 0.406: v121.02,20.32 v142.61,20.32
EEPROM_A05  (via drill 0.6)
  Top 0.406: IC3.1 124.83,44.68 124.83,45.72 128.64,49.53 v129.91,49.53 | v135.62,50.8 135.62,49.59 IC5.8
  Bottom 0.406: v129.91,49.53 133.72,49.53 134.99,50.8 v135.62,50.8
GND  (via drill 0.51, 0.6)
  Top 0.406: C2.- 21.53,88.94 C3.- | 17.96,82.66 17.93,82.7 | 13.07,81.28 SR(5V).1 | v150.23,78.74 v150.23,74.93 | v71.49,40.64 75.3,36.83 75.3,25.89 DISPLAY.18
  Top 0.61: 17.96,82.66 17.98,82.64 | LED10.2 8.41,50.38 9.83,48.96 SPG-EXT.2 | v28.31,52.07 23.47,52.07 GND.1 | v71.49,54.61 71.49,52.07 v72.76,50.8
  Top 0.813: 17.93,82.7 C2.- | 17.51,82.66 14.45,82.66 13.07,81.28 | 17.51,82.66 17.96,82.66 | 17.98,82.64 C4.- | 17.51,82.66 17.51,66.04 16.24,64.77 9.26,64.77 8.41,63.92 LED11.2 LED10.2
  Top 1.016: K1.6 23.23,92.71 23.21,92.7 21.37,92.7 | K1.6 23.27,92.75 | 37.66,90.18 37.66,90.19 | VCC-BUCHSE.3 35.02,92.28 USB.1 27.11,95.39 24.68,95.39 23.95,94.66 K1.6 | 37.66,90.19 VCC-BUCHSE.2 38.09,95.89 46.22,95.89 46.22,96.65 47.23,97.66 97.4,97.66 v97.4,84.07 | VCC-BUCHSE.3 35.22,87.2 USB.3 30.22,81.18 SR(3.3V).1 | 21.37,92.7 C1.- | C3.- 21.55,92.52 21.37,92.7 | 37.66,90.19 37.71,90.17 VCC-BUCHSE.3
  Bottom 0.406: T2.2 T4.2 T6.2 T8.2 105.46,86.04 104.51,85.09 104.51,83.82 104.51,81.28 104.83,80.96 T7.2 T5.2 T3.2 T1.2 127.05,80.96 128.96,82.87 D17.1 D15.1 D13.1 D11.1 148.64,82.87 150.23,81.28 v150.23,78.74 | D12.1 D10.1 149.28,73.98 v150.23,74.93 152.77,74.93 156.58,71.12 156.58,40.64 155.44,39.5 C9.- 154.12,38.95 C10.2 | D12.1 140.24,73.83 140.07,73.66 | D12.1 D14.1 D16.1 | D7.1 D6.1 D27.1 D26.1 D22.1 D20.1 D3.1 D5.1 D25.1 | D23.1 D21.1 D2.1 D4.1 | R34.1
  Bottom 0.61: R34.1 14.63,48.96 SPG-EXT.2 SPG-EXT.3 | DISPLAY.18 DISPLAY.19 DISPLAY.20 | R34.1 16.88,50.8 22.2,50.8 GND.1 23.47,52.07 | v28.31,52.07 32.12,52.07 34.49,49.7 D7.1 | v71.49,40.64 71.49,42.06 D24.1 76.89,42.23 77.84,43.18 77.84,48.26 76.89,49.21 D25.1 73.54,50.8 v72.76,50.8 | D4.1 71.17,54.29 v71.49,54.61
  Bottom 1.016: v97.4,84.07 97.65,83.82 104.51,83.82
IN0  (via drill 0.3, 0.6)
  Top 0.152: v61.33,53.34 v64.12,56.13 | v78.86,56.13 94.35,40.64
  Top 0.406: v61.33,53.34 60.06,53.34 58.79,52.07 R9.11 | U$1.26 121.89,11.03 121.02,10.16 108.32,10.16 94.35,24.13 94.35,40.64
  Bottom 0.152: v64.12,56.13 v78.86,56.13
  Bottom 0.406: v61.33,53.34 D2.3
IN1  (via drill 0.3, 0.6)
  Top 0.152: v66.16,46.48 65.9,46.48 64.25,48.13 61.46,48.13 v61.33,48.26 | v94.98,41.15 95.49,40.64 95.62,40.64
  Top 0.406: v61.33,48.26 58.79,48.26 57.52,49.53 R9.12 | U$1.27 119.35,12.3 118.48,11.43 108.32,11.43 95.62,24.13 95.62,40.64
  Bottom 0.152: v66.16,46.48 70.6,42.04 70.6,39.75 93.59,39.75 v94.98,41.15
  Bottom 0.406: v61.33,48.26 D3.3
IN2  (via drill 0.6)
  Top 0.406: v66.41,53.34 63.93,53.34 R9.9 | U$1.33 103.9,20.93 99.43,25.4 99.43,41.27 v96.89,43.81
  Bottom 0.406: v66.41,53.34 D4.3 86.73,53.34 96.25,43.81 v96.89,43.81
IN3  (via drill 0.3, 0.6)
  Top 0.152: v88.38,55.37 87.11,55.37 86.98,55.5 v83.17,55.5 | v68.82,55.12 67.3,53.59 67.3,52.7 66.54,51.94 66.54,48.39 v66.41,48.26
  Top 0.406: v66.41,48.26 64.82,48.26 63.87,49.21 60.69,49.21 60.06,49.85 R9.10
  Bottom 0.152: v88.38,55.37 102.99,55.37 103.24,55.12 111.62,55.12 111.62,61.47 U$1.51 | v83.17,55.5 69.2,55.5 v68.82,55.12
  Bottom 0.406: v66.41,48.26 D5.3
INP0
  Top 0.305: PFOSTENSTIFTE.13 52.44,40.64
  Top 0.406: 52.44,40.64 R9.1
INP1
  Top 0.305: R9.2 53.71,38.1 PFOSTENSTIFTE.14
INP2
  Top 0.305: PFOSTENSTIFTE.15 54.98,40.64
  Top 0.406: 54.98,40.64 R9.3
INP3
  Top 0.305: R9.4 56.25,38.1 PFOSTENSTIFTE.16
INP4
  Top 0.305: PFOSTENSTIFTE.17 57.52,40.64
  Top 0.406: 57.52,40.64 R9.5
INP5
  Top 0.305: R9.6 58.79,38.1 PFOSTENSTIFTE.18
INP6
  Top 0.305: PFOSTENSTIFTE.19 60.06,40.64
  Top 0.406: 60.06,40.64 R9.7
INP7
  Top 0.305: R9.8 61.33,38.1 PFOSTENSTIFTE.20
MOVEMOVE  (via drill 0.6)
  Top 0.406: v123.56,82.55 123.56,76.89 R-SIL.8 124.85,75.6 124.85,71.14 123.38,69.67 IC2.5
  Bottom 0.406: T2.1 121.97,84.14 v123.56,82.55
N$1
  Bottom 0.406: 31.97,30.3 R22.1
  Bottom 0.61: DISPLAY.1 31.97,30.3
N$2
  Top 0.406: S1.2 95.36,10 R42.1 97.31,8.47 99.43,6.35 R14.2
N$3
  Top 0.406: R42.2 96.89,3.81 95.62,2.54 LED12.1
N$4
  Bottom 0.406: 34.51,30.34 R23.1
  Bottom 0.61: DISPLAY.2 34.51,30.34
N$5
  Top 0.406: U$1.20 R50.2
N$6
  Top 0.406: R49.2 27.04,3.81 25.77,2.54 LED19.1
N$7
  Bottom 0.406: R24.1
  Bottom 0.61: DISPLAY.3 R24.1
N$8
  Top 0.406: R48.2 37.2,3.81 35.93,2.54 LED18.1
N$9
  Bottom 0.406: DISPLAY.31 54.83,65.66 C23.1
N$10
  Top 0.406: R47.2 47.36,3.81 46.09,2.54 LED17.1
N$11
  Top 0.813: LED11.1 R37.2
N$12
  Top 0.813: LED10.1 R38.2
N$13
  Top 0.406: R46.2 57.52,3.81 56.25,2.54 LED16.1
N$14
  Top 0.406: R45.2 66.41,3.81 65.14,2.54 LED15.1
N$15
  Top 0.406: R44.2 76.57,3.81 75.3,2.54 LED14.1
N$16
  Bottom 0.305: IC1.5 75.39,77.56 74.66,76.83 C14.1
N$17  (via drill 0.6)
  Top 1.016: D1.A 29.47,96.97 v30.55,95.88
  Bottom 1.016: v30.56,95.88 v30.55,95.88 33.76,92.67 33.76,87.62 35.77,85.61 40.9,85.61 42.46,87.17 VCC-BUCHSE.1
N$18
  Top 0.406: R43.2 86.73,3.81 85.46,2.54 LED13.1
N$19
  Top 0.406: R49.1 R21.2 22.56,9.31 S8.2
N$20
  Top 0.406: S7.2 32.56,9.31 R20.2 R48.1
N$21
  Top 0.406: S6.2 42.56,9.31 R19.2 R47.1
N$22
  Top 0.406: R46.1 R18.2 52.56,9.31 S5.2
N$23
  Bottom 0.406: DISPLAY.21 C22.1
N$24
  Bottom 0.406: DISPLAY.22 C21.1
N$25
  Bottom 0.406: DISPLAY.23 75.17,68.92 C20.1
N$26
  Bottom 0.406: DISPLAY.24 72.65,68.92 C19.1
N$27
  Bottom 0.406: LED1.A 95.72,21.27 R1.1
N$28
  Bottom 0.406: LED2.A 85.56,21.27 R2.1
N$29
  Bottom 0.406: LED3.A 75.4,21.27 R3.1
N$30
  Bottom 0.406: R4.1 62.19,21.59 LED4.A
N$31
  Bottom 0.406: LED5.A 55.08,21.27 R5.1
N$32
  Bottom 0.406: LED6.A 46.19,21.27 R6.1
N$33
  Bottom 0.406: LED7.A 32.44,21.27 33.39,20.32 R7.1
N$34
  Bottom 0.406: LED8.A 25.63,21.27 R8.1
N$35
  Bottom 0.406: DISPLAY.32 C17.1
N$36
  Bottom 0.406: DISPLAY.25 C18.1
N$37
  Bottom 0.406: DISPLAY.29 C24.1
N$38
  Bottom 0.406: C23.2 56.25,63.93 | 56.25,63.93 C24.2 | DISPLAY.30 57.37,65.05 56.25,63.93
N$39
  Bottom 0.406: C25.2 DISPLAY.27
N$40
  Bottom 0.406: C25.1 63.44,63.93 62.45,64.92 DISPLAY.28
N$41
  Top 0.406: 66.41,10.16 R45.1 | 66.41,10.16 R17.2 | S4.2 66.25,10 66.41,10.16
N$42
  Bottom 0.61: R34.2 16.18,47.05 16.88,46.35 19.46,46.35 R33.2 19.5,46.31 R32.2
N$43
  Top 0.406: R35.1 126.96,35.14 LED9.A
N$44
  Top 0.406: 76.57,10.16 R44.1 | 76.57,10.16 R16.2 | S3.2 76.41,10 76.57,10.16
N$45
  Top 0.406: 86.73,10.16 R15.2 | 86.73,10.16 R43.1 | 86.73,10.16 81.87,10.16 S2.2
N$46
  Top 0.406: U$1.21 R52.2
N$47
  Top 0.305: IC4.5 135.47,24.8 R50.1
N$48
  Top 0.305: R51.2 U$1.25
N$50
  Bottom 0.305: C15.2 72.12,80.01 72.76,80.64 76.57,80.64 77.34,79.88 IC1.2
N$51  (via drill 0.6)
  Top 0.406: v42.28,59.69 OP1.4
  Bottom 0.406: L2.2 C33-OP1.2 38.89,53.76 42.28,57.15 v42.28,59.69
N$53
  Top 0.406: U$1.22 R53.2
N$55  (via drill 0.6)
  Top 0.406: LED20.2 v140.07,39.37 | v140.07,42.55 140.07,43.18 139.23,44.02 IC5.12
  Bottom 0.406: v140.07,39.37 v140.07,42.55
N$56
  Top 0.406: IC5.2 143.04,42.75 143.88,41.91 143.88,38.95 LED21.2
N$57
  Top 0.406: R54.2 LED21.1
N$58
  Top 0.406: R25.2 LED20.1
N$59
  Top 0.406: IC5.9 IC5.6
N$61
  Top 0.406: IC5.11 IC5.4
OC0  (via drill 0.6)
  Top 0.305: IC4.12 134.17,31.3 134.35,31.11 140.7,31.11 v141.34,30.48
  Bottom 0.305: v141.34,30.48 141.34,31.75 144.51,34.92 148.32,34.92 148.96,34.29
  Bottom 0.406: D-SUB-25.6 126.98,92.32 128,93.34 149.59,93.34 152.77,96.52 156.58,96.52 157.85,95.25 157.85,35.56 156.58,34.29 148.96,34.29
OC1  (via drill 0.6)
  Top 0.305: IC4.13 133.52,30.68 133.72,30.48 140.07,30.48 v141.34,29.21
  Bottom 0.305: v141.34,29.21 142.61,29.21 145.78,32.38 148.32,32.38 148.96,33.02
  Bottom 0.406: D-SUB-25.19 125.6,93.48 126.73,94.61 149.59,94.61 152.77,97.79 157.85,97.79 159.12,96.52 159.12,34.29 157.85,33.02 148.96,33.02
OUT+5V
  Top 1.016: SR(5V).TAB SR(5V).2 10.55,80.66 10.55,84.39 K1.14 11.25,86.98 13.23,88.96 15.1,88.96 C2.+
P1.0
  Top 0.406: R14.1 99.43,2.54 100.7,1.27 157.85,1.27 159.12,2.54 159.12,29.21 157.85,30.48 148.96,30.48 148.35,31.09 U$1.12
P1.1
  Top 0.406: R15.1 87.58,13.55 88,13.97 94.35,13.97 101.33,6.99 101.33,3.17 101.97,2.54 156.58,2.54 157.85,3.81 157.85,26.67 155.97,28.55 U$1.13
P1.2
  Top 0.406: R16.1 76.57,13.97 77.84,15.24 94.35,15.24 102.6,6.99 102.6,4.45 103.24,3.81 155.31,3.81 156.58,5.08 156.58,24.13 154.7,26.01 U$1.14
P1.3
  Top 0.406: R17.1 66.41,13.97 68.31,15.88 94.98,15.88 103.87,6.99 103.87,5.71 104.51,5.08 149.59,5.08 155.31,10.79 155.31,21.59 153.43,23.47 U$1.15
P1.4  (via drill 0.6)
  Top 0.406: C32.1 v57.52,12.7 R18.1
  Bottom 0.406: U$1.16 157.24,20.93 159.12,19.05 159.12,2.54 157.85,1.27 99.43,1.27 98.79,1.91 98.79,9.53 94.35,13.97 60.06,13.97 58.79,12.7 v57.52,12.7
P1.5  (via drill 0.6)
  Top 0.406: C31.1 v47.36,12.7 R19.1
  Bottom 0.406: v47.36,12.7 47.68,12.7 50.22,15.24 94.35,15.24 100.06,9.53 100.06,3.17 100.7,2.54 156.58,2.54 157.85,3.81 157.85,16.51 155.97,18.39 U$1.17
P1.6  (via drill 0.6)
  Top 0.406: v37.2,12.7 C30.1 R20.1
  Bottom 0.406: v37.2,12.7 38.47,12.7 42.28,16.51 94.35,16.51 101.33,9.53 101.33,4.45 101.97,3.81 155.31,3.81 156.58,5.08 156.58,15.24 155.31,16.51 143.88,16.51 142.21,18.18 U$1.18
P1.7  (via drill 0.6)
  Top 0.406: C29.1 v27.04,12.7 R21.1
  Bottom 0.406: v27.04,12.7 28.31,12.7 32.75,17.14 94.98,17.14 102.6,9.53 102.6,5.71 103.24,5.08 149.59,5.08 155.31,10.79 155.31,13.97 154.04,15.24 142.82,15.24 U$1.19
P3.2_PWM
  Top 0.406: R10.1 112.76,17.35 U$1.30
P4.0  (via drill 0.6)
  Top 0.305: 138.4,58.79 138.42,63.02
  Top 0.406: R26.16 140.81,78.74 v147.69,78.74 147.52,78.57 D10.3 147.52,73.49 138.42,64.39 138.42,63.02 | 138.4,58.79 130.54,50.8 128.64,50.8 108.32,30.48 108.32,29.84 107.05,28.57 104.13,28.57 U$1.36
  Bottom 0.406: D10.3 147.52,78.57 v147.69,78.74 | R1.2 97.74,22.18 U$1.36
P4.1  (via drill 0.6)
  Top 0.305: 135.85,58.95 135.85,62.5
  Top 0.406: v148.96,83.82 146.42,83.82 145.15,82.55 141.34,82.55 139.11,80.32 R26.15 139.11,78.43 140.07,77.47 145.15,77.47 146.42,76.2 146.42,73.66 135.85,63.09 135.85,62.5 | U$1.37 106.39,31.09 128.64,53.34 129.91,53.34 135.52,58.95 135.85,58.95
  Bottom 0.406: v148.96,83.82 D11.3 | R2.2 89.27,21.59 91.81,24.13 96.89,24.13 103.85,31.09 U$1.37
P4.2  (via drill 0.6)
  Top 0.305: 133.34,60.33 133.33,62.64
  Top 0.406: R26.14 137.84,78.43 140.07,76.2 142.61,76.2 v143.88,74.93 143.88,73.19 133.33,62.64 | U$1.38 107.66,33.63 133.34,59.31 133.34,60.33
  Bottom 0.406: v143.88,74.93 D12.3 | R3.2 79.11,21.59 81.65,24.13 89.27,24.13 90.54,25.4 95.88,25.4 U$1.38
P4.3  (via drill 0.6)
  Top 0.305: 130.79,60.26 130.78,62.6
  Top 0.406: v143.88,83.82 140.7,83.82 139.43,82.55 137.53,82.55 136.57,81.59 R26.13 136.57,78.43 140.07,74.93 140.07,72.39 130.78,63.1 130.78,62.6 | U$1.39 108.93,36.17 130.79,58.03 130.79,60.26
  Bottom 0.406: v143.88,83.82 D13.3 | U$1.39 95.88,27.94 74.03,27.94 67.68,21.59 R4.2
P4.4  (via drill 0.6)
  Top 0.305: 128.24,60.28 128.24,62.68
  Top 0.406: R26.12 135.3,78.43 v138.8,74.93 138.8,72.39 129.91,63.5 129.06,63.5 128.24,62.68 | U$1.40 110.2,38.71 128.24,56.75 128.24,60.28
  Bottom 0.406: R5.2 58.79,21.59 61.33,24.13 68.95,24.13 74.03,29.21 94.61,29.21 U$1.40 | v138.8,74.93 D14.3
P4.5  (via drill 0.6)
  Top 0.305: 125.7,60.44 125.7,62.7
  Top 0.406: v138.8,83.82 136.26,83.82 134.03,81.59 R26.11 134.03,77.16 134.99,76.2 134.99,71.12 127.37,63.5 126.5,63.5 125.7,62.7 | U$1.41 111.47,41.25 125.7,55.48 125.7,60.44
  Bottom 0.406: v138.8,83.82 D15.3 | R6.2 49.9,21.59 53.71,25.4 68.95,25.4 74.03,30.48 93.34,30.48 U$1.41
P4.6  (via drill 0.6)
  Top 0.305: 123.17,60.39 123.17,62.44
  Top 0.406: R26.10 132.76,75.89 v133.72,74.93 133.72,72.97 123.77,63.02 123.17,62.44 | U$1.42 112.74,43.79 123.17,54.22 123.17,60.39
  Bottom 0.406: v133.72,74.93 D16.3 | U$1.42 92.07,31.75 74.03,31.75 68.95,26.67 44.82,26.67 38.47,20.32 R7.2
P4.7  (via drill 0.6)
  Top 0.305: 120.62,60.4 120.62,62.43
  Top 0.406: v133.72,83.82 133.72,82.55 131.49,80.32 R26.9 131.49,72.06 122.92,63.5 121.02,63.5 120.62,63.1 120.62,62.43 | U$1.43 114.01,46.33 120.62,52.94 120.62,60.4
  Bottom 0.406: v133.72,83.82 D17.3 | R8.2 28.96,21.6 30.21,22.86 39.74,22.86 44.82,27.94 68.95,27.94 74.03,33.02 90.8,33.02 U$1.43
PWR-5
  Top 0.61: SR(5V).3 7.99,86.36
  Top 1.016: K1.2 13.79,92.16 7.99,86.36 | K1.2 C1.+ | K1.2 13.79,96.73 14.01,96.95 15.84,96.95 D1.C
R1IN
  Bottom 0.305: IC1.13 76.04,89.04 RS232.3
R26.1
  Top 0.406: R26.1 140.38,88.63 D-SUB-25.1
R26.2
  Top 0.406: D-SUB-25.14 139.43,91.91 139.43,87 R26.2
R26.3
  Top 0.406: R26.3 137.84,88.86 D-SUB-25.2
R26.4
  Top 0.406: D-SUB-25.15 136.68,86.78 R26.4
R26.5
  Top 0.152: 135.3,89.03 135.37,89.03 D-SUB-25.3
  Top 0.406: R26.5 135.3,89.03 D-SUB-25.3
R26.6
  Top 0.406: D-SUB-25.16 133.91,86.79 R26.6
R26.7
  Top 0.406: R26.7 132.76,88.84 D-SUB-25.4
R26.8
  Top 0.406: D-SUB-25.17 131.14,87.02 R26.8
RX  (via drill 0.6)
  Top 0.305: v81.6,90.66 81.62,90.67
  Top 0.406: U$1.35 102.63,26.01 101.97,26.67 101.97,44.45 100.7,45.72 98.16,45.72 94.35,49.53 94.35,85.09 91.81,87.63 86.73,87.63 83.7,90.66 v81.6,90.66
  Bottom 0.305: IC1.12 75.39,85.1 75.39,87.84 74.85,88.38 74.85,89.68 75.83,90.66 v81.6,90.66
S10  (via drill 0.6)
  Top 0.406: S11.P2 51.59,88.47 C37.2 52.44,87.63 | R27.1 51.17,86.36 52.44,87.63 | 52.44,87.63 82.28,87.63 84.82,85.09 90.54,85.09 91.81,83.82 v91.81,63.5
  Bottom 0.406: U$1.58 129.51,62.63 127.37,64.77 104.51,64.77 103.24,66.04 94.35,66.04 v91.81,63.5
SCL  (via drill 0.6)
  Top 0.305: IC4.11 134.82,38.27 133.72,39.37 130.54,39.37 129.27,40.64 129.27,41.91 129.49,42.13 IC3.6 133.3,42.13 133.93,42.75 IC5.13 | 118.09,60.37 118.09,62.49
  Top 0.406: D-SUB-25.18 126.94,93.34 106.41,93.34 104.51,91.44 104.51,72.39 109.77,67.13 IC2.14 116.12,67.13 117.21,66.04 117.21,63.5 118.09,62.49 | 118.09,60.37 118.09,53.73 v118.48,53.34 | 129.27,41.91 v128.64,41.91
  Bottom 0.406: v118.48,53.34 118.48,52.07 v128.64,41.91
SCL_INT
  Bottom 0.406: R12.1 110.86,23.75 I2C.3 111.16,21.89 109.19,19.92 U$1.31
SDA  (via drill 0.6)
  Top 0.305: IC4.10 135.47,35.56 135.47,38.89 | IC3.5 133.5,40.86 135.47,38.89 | IC5.1 140.91,41.48 138.32,38.89 135.47,38.89 | 115.55,60.34 115.55,62.52
  Top 0.406: D-SUB-25.5 129.91,89.24 129.91,92.71 128,94.61 106.41,94.61 103.24,91.44 103.24,72.39 109.77,65.86 IC2.15 113.58,65.86 115.55,63.89 115.55,62.52 | 115.55,60.34 115.55,53.73 v117.21,52.07 | 135.47,35.56 v136.89,35.56
  Bottom 0.406: v117.21,52.07 117.21,50.8 132.45,35.56 v136.89,35.56
SDA_INT
  Bottom 0.406: R11.1 113.7,27.42 I2C.2 113.7,21.29 114.27,20.72 U$1.29
SIMO
  Bottom 0.406: U$1.45 SPI.5 91.2,51.41 82.92,59.69 82.92,69.85 81.65,71.12 43.55,71.12 42.13,69.7 DISPLAY.36
SOMI
  Top 0.406: R13.2 96.53,52.98 97.5,53.95 SPI.4
  Bottom 0.406: SPI.4 U$1.46
SPI_CS
  Bottom 0.305: 102.6,57.78 105.14,57.78
  Bottom 0.406: SPI.2 101.36,59.03 102.6,57.78 | 105.14,57.78 105.4,57.78 U$1.50
STE
  Bottom 0.406: U$1.44 103.85,48.87 89.27,34.29 74.03,34.29 68.95,29.21 44.82,29.21 39.1,23.5 30.21,23.5 27.04,26.67 27.04,63.98 DISPLAY.40
T1  (via drill 0.6)
  Top 0.406: v124.83,80.01 124.83,86.36 124.21,86.98 D-SUB-25.7
  Bottom 0.406: T1.3 v124.83,80.01
T1OUT
  Bottom 0.305: IC1.14 76.69,85.1 76.69,88.02 77.75,89.08 RS232.2
T2  (via drill 0.6)
  Top 0.406: D-SUB-25.20 122.83,87.73 v122.92,87.63
  Bottom 0.406: v122.92,87.63 122.92,85.66 T2.3
T3  (via drill 0.6)
  Top 0.406: D-SUB-25.8 121.44,81.7 v119.75,80.01
  Bottom 0.406: T3.3 v119.75,80.01
T4  (via drill 0.6)
  Top 0.406: D-SUB-25.21 120.06,85.4 v119.75,85.09
  Bottom 0.406: T4.3 v119.75,85.09
T5  (via drill 0.6)
  Top 0.406: v114.67,80.01 115.94,80.01 118.67,82.74 D-SUB-25.9
  Bottom 0.406: T5.3 v114.67,80.01
T6  (via drill 0.6)
  Top 0.406: v114.67,85.09 115.94,85.09 117.29,86.44 D-SUB-25.22
  Bottom 0.406: T6.3 v114.67,85.09
T7  (via drill 0.6)
  Top 0.406: D-SUB-25.10 115.9,87.59 114.67,86.36 113.4,86.36 112.13,85.09 112.13,82.55 v109.59,80.01
  Bottom 0.406: T7.3 v109.59,80.01
T8  (via drill 0.6)
  Top 0.406: v109.59,85.09 109.59,86.36 110.86,87.63 114.03,87.63 114.52,88.11 D-SUB-25.23
  Bottom 0.406: T8.3 v109.59,85.09
TX  (via drill 0.6)
  Top 0.406: v84.19,87.63 85.46,86.36 90.54,86.36 93.08,83.82 93.08,49.53 98.16,44.45 99.43,44.45 100.7,43.18 100.7,25.4 102.63,23.47 U$1.34
  Bottom 0.406: IC1.11 74.73,85.11 74.73,86.86 74.32,87.27 72.64,87.27 71.78,88.13 71.78,89.8 73.19,91.21 73.19,93.16 74.32,94.29 81.89,94.29 83.02,93.16 83.02,88.8 v84.19,87.63
UCLK
  Bottom 0.406: U$1.47 SPI.3 87.39,56.49 84.19,59.69 84.19,71.12 82.92,72.39 42.28,72.39 39.59,69.7 DISPLAY.37
USB  (via drill 0.7)
  Top 1.016: K1.1 10.53,92.68 9.26,91.44 v9.26,90.3
  Bottom 1.27: v9.26,90.3 9.82,89.74 USB.2
V-
  Bottom 0.305: 72.88,76.56 72.88,74.93 72.03,74.08 C16.2 | IC1.6 74.74,78.18 74.13,77.57 73.3,77.57 72.88,77.15 72.88,76.56 | 72.88,76.56
VCC-EEPROM
  Top 0.406: 129.91,44.67 129.69,44.67 | 129.91,44.67 IC3.8 130.4,45.42 C34.1 | S10.3 125.77,24.46 124.83,25.4 R35.2 124.41,33.44 123.56,34.29 123.56,36.83 127.37,40.64 127.37,42.13 129.91,44.67
VOUTA  (via drill 0.6)
  Top 0.406: OP1.2 OP1.1 46.09,60.96 51.17,64.77 82.92,64.77 v85.46,62.23
  Bottom 0.406: v85.46,62.23 86.73,63.5 93.08,68.58 103.24,68.58 104.51,67.31 129.91,67.31 131.18,68.58 133.72,68.58 134.99,67.31 R28.2
VOUTB  (via drill 0.6)
  Top 0.406: OP1.7 OP1.6 39.74,64.14 41.01,65.41 84.82,65.41 v88,62.23
  Bottom 0.406: v88,62.23 94.35,67.31 103.24,67.31 104.51,66.04 132.23,66.04 R30.2
VOUTC  (via drill 0.3)
  Top 0.152: v68.44,62.74 62.73,62.74 62.6,62.87 | v74.41,56.77 91.81,39.37
  Top 0.406: OP1.8 OP1.9 39.74,53.34 41.01,54.61 47.36,54.61 55.61,62.87 62.6,62.87 | R39.2 131.18,11.43 127.37,7.62 108.32,7.62 91.81,24.13 91.81,39.37
  Bottom 0.152: v68.44,62.74 v74.41,56.77
VOUTD
  Top 0.152: OP1.14 46.22,51.44 50.28,47.37 57.14,47.37 57.14,49.15 56.88,49.4 56.88,51.94 63.62,58.67 78.09,58.67 78.09,55.63 93.08,40.64
  Top 0.406: OP1.13 OP1.14 46.09,52.07 56.25,62.23 62.6,62.23 | R41.2 126.1,12.7 122.29,8.89 108.32,8.89 93.08,24.13 93.08,40.64
WP  (via drill 0.6)
  Top 0.406: v142.61,21.59 144.51,23.5 144.51,43.81 144.31,44.02 IC5.3
  Bottom 0.406: U$1.28 116.81,19.92 118.48,21.59 v142.61,21.59
WP5
  Top 0.406: IC3.7 132.67,43.4 133.72,44.45 133.72,45.72 134.56,46.56 IC5.10

## Text on the board
Top: 64 | 3V3 | +5V | 1 | 2 | 16 | G.CASCINO | BOCASboard | A.BODE | S8 | S7 | S6 | S5 | S4 | S3 | S2 | S1 | TOP
Bottom: | | + | | | SPI_CS | 49 | 1 | UCLK | SOMI | GND | SIMO | 3,3V | AGND | GND | DGND | GND | +5V | 1 | 2 | 32 | BOTTOM
tDocu: - | +